# Altium project LEARNSAT_POBOY_v3.2.0.PrjPcb (part 1 of 2)
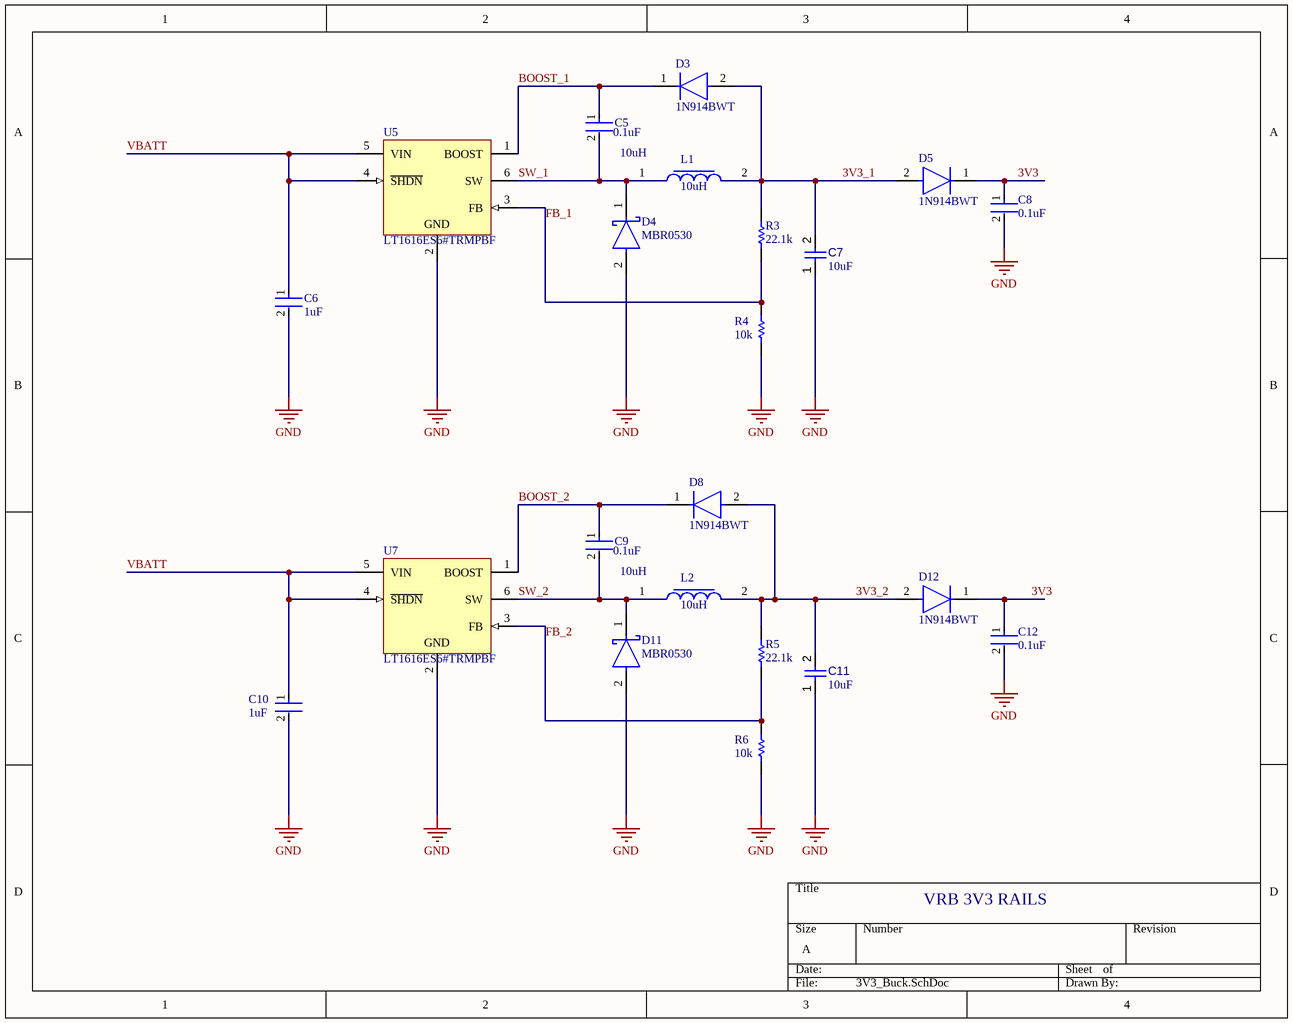
[diagram p0: 3V3_Buck.SchDoc]
15 sheets, 250 parts. Net scope: flat (ports and power ports of the same name join across sheets).
Board file: PoBoI.PcbDoc
Sheets:
  3V3_Buck.SchDoc
  3V3Primary.SchDoc
  3V3Secondary.SchDoc
  5V_Buck.SchDoc
  5VPrimary.SchDoc
  5VSecondary.SchDoc
  12V_BOOST.SchDoc
  MemoryLatch.SchDoc
  PC104.SchDoc
  STM32.SchDoc
  TVS_Diodes.SchDoc
  VBATTPrimary.SchDoc
  VBATTSecondary.SchDoc
  WatchDog.SchDoc
  12VPrimary.SchDoc

## Sheet 3V3_Buck.SchDoc
size A; SheetNumber: 1; SheetTotal: 15; SPICEModelCacheKMHHWGDA: <root> / <DocumentId>KMHHWGDA</DocumentId> / <CacheFrame Number="0"> / <Model Name="lm317" Kind="CKT"> / <Text>*------------------------------------------------- / * POSITIVE ADJUSTABLE VOLTAGE REGULATOR / .SUBCKT LM317 IN ADJ OUT / JADJ IN ADJ ADJ JADJMOD / VREF 4 ADJ 1.250 / DBK IN 13 DMOD / CBC 13 15 800.0E-12 / RBC 15 5 1.000E3 / QPASS 13 5 OUT QPASSMOD / RB1 7 6 1 / RB2 6 5 128.3 / DSC 6 11 DMOD / ESC 11 OUT VALUE={5.646-.6667*V(6,5)*V(13,5)} / DFB 6 12 DMOD / EFB 12 OUT VALUE={8.822-.4024*V(13,5)+5.250E-3*V(13,5)*V(13,5) -.6667*V(13,5)*V(6,5)} / EB 7 OUT 8 OUT 6.939 / RP 9 8 100 / CPZ 10 OUT 3.183E-6 / DPU 10 OUT DMOD / RZ 8 10 .1 / EP 9 OUT 4 OUT 100 / RI OUT 4 100MEG / .MODEL QPASSMOD NPN (IS=30F BF=50 VAF=1.500 NF=1.701) / .MODEL JADJMOD NJF (BETA=50.00E-6 VTO=-1) / .MODEL DMOD D (IS=30F N=1.701) / .ENDS</Text> / </Model> / </CacheFrame> / </root>

### Parts
(Parts that share a designator on the sheet are numbered #1, #2 ... from top to bottom, then left to right.)
C5#1  0.1uF  [FP-C0603-CJ-MFG]
C6#1  1uF  [FP-CL10-IPC_B]
C7#1  value 10uF  [CAPC0603(1608)100_L]  (hidden comment: Capacitor 10µF +/-20% 10V 0603)
C8#1  0.1uF  [FP-C0603-CJ-MFG]
C9  0.1uF  [FP-C0603-CJ-MFG]
C10#1  1uF  [FP-CL10-IPC_B]
C11#1  value 10uF  [CAPC0603(1608)100_L]  (hidden comment: Capacitor 10µF +/-20% 10V 0603)
C12#1  0.1uF  [FP-C0603-CJ-MFG]
D3#1  1N914BWT  [FP-502-01-MFG]
D4#1  MBR0530  [FP-425-04-MFG]
D5  1N914BWT  [FP-502-01-MFG]
D8  1N914BWT  [FP-502-01-MFG]
D11  MBR0530  [FP-425-04-MFG]
D12  1N914BWT  [FP-502-01-MFG]
L1#1  Inductance: 10uH  [INDM3532X15N]  (hidden comment: PA4547.103NLT)
L2#1  Inductance: 10uH  [INDM3532X15N]  (hidden comment: PA4547.103NLT)
R3  22.1k  [RESC1609X50X30LL10T20]
R4  10k  [RESC1609X50X30NL8T20]
R5  22.1k  [RESC1609X50X30LL10T20]
R6  10k  [RESC1609X50X30NL8T20]
U5  LT1616ES6#TRMPBF  [LT-S6-6-SOT-23_M]
U7  LT1616ES6#TRMPBF  [LT-S6-6-SOT-23_M]

### Nets
GND: C6#1.2 C7#1.1 C8#1.2 C10#1.2 C11#1.1 C12#1.2 D4#1.2(A) D11.2(A) R4.1 R6.1 U5.2(GND) U7.2(GND)
3V3: C8#1.1 C12#1.1 D5.1(C) D12.1(C)
3V3_1: C7#1.2 D3#1.2(A) D5.2(A) L1#1.2 R3.2
3V3_2: C11#1.2 D8.2(A) D12.2(A) L2#1.2 R5.2
BOOST_1: C5#1.1 D3#1.1(C) U5.1(BOOST)
BOOST_2: C9.1 D8.1(C) U7.1(BOOST)
FB_1: R3.1 R4.2 U5.3(FB)
FB_2: R5.1 R6.2 U7.3(FB)
SW_1: C5#1.2 D4#1.1(C) L1#1.1 U5.6(SW)
SW_2: C9.2 D11.1(C) L2#1.1 U7.6(SW)
VBATT: C6#1.1 C10#1.1 U5.4(~{SHDN}) U5.5(VIN) U7.4(~{SHDN}) U7.5(VIN)

### Notes on the sheet
- (near L1#1) 10uH
- (near L2#1) 10uH
- VRB 3V3 RAILS

### Library data of the parts
C5#1 C8#1 C9 C12#1 = CMP-2006-03300-2: CAP CER 0.1UF 50V X7R 0603 / C0603X104K5RACTU; Manufacturer: Kemet; Capacitance: 100nF; Material: Ceramic; Tolerance: 10%; Value: 100nF; Temperature Coefficient: 15%; Temperature Range High: +125°C; Temperature Range Low: -55°C; Manufacturer Part Number: C0603X104K5RACTU; Voltage: 50V; ComponentLink2Description: Datasheet; RoHS: TRUE; ComponentLink2URL: https://content.kemet.com/datasheets/KEM_C1013_X7R_FT-CAP_SMD.pdf; Device Class L3: Ceramic Capacitors; Device Class L2: Capacitors; Package: C0603-CJ; Height: 0.95mm; Device Class L1: Passive Components; Temperature Characteristic: X7R; Lead Free: Yes; Digikey Description: CAP CER 0.1UF 50V X7R 0603; Automotive: No; Mouser Description: Capacitor; Ceramic; Cap 0.1uF; Tol+10%; SMT; Flexible Termination; Vol-Rtg 50V; TR; Temperature: -55°C to +125°C; Octopart: https://octopart.com/c0603x104k5ractu-kemet-9145062; Category: Cap; Voltage Rating: 50V; Ipc Land Pattern Name: CAPC16080X80
C6#1 C10#1 = CMP-13271-001107-1: Cap Ceramic 1uF 25V X7R ±10% Pad SMD 0603 +125°C T/R; Width: 0.031inch; Voltage Rating: 25V; Length: 0.063inch; Min Operating Temperature: -55°C; Package Quantity: 1; Tolerance: 10%; Case Code (Metric): 1608; Case/Package: 0603; Mount: Surface Mount; Thickness: 0.035inch; Lead Free: Lead Free; Case Code (Imperial): 0603; Capacitance: 1uF; Depth: 0.8mm; Dielectric: X7R; Max Operating Temperature: 125°C; Radiation Hardening: No; Packaging: Tape and Reel; Height: 0.8mm
C7#1 C11#1 = CMP-001-00075-4: Chip Capacitor, 10µF +/-20%, 10V, 0603, Thickness 1 mm; Tolerance: 10%; Voltage Rating: 10V; Max Operating Temperature: 85°C; Pins: 2; Case/Package: 0603; Mounting Technology: SMT; Min Operating Temperature: -55°C
D3#1 D5 D8 D12 = CMP-07163-000008-1: DIODE GEN PURP 75V 200MA SOD523F; Manufacturer: ON Semiconductor; Forward Current: 300mA; Capacitance: 4pF; Max Junction Temp: +150°C; Reverse Voltage: 100V; Value: 4pF; Peak Reverse Current: 5uA; ComponentLink2Description: Datasheet; Package: 502-01; Manufacturer Part Number: 1N914BWT; Digikey Description: DIODE GEN PURP 75V 200MA SOD523F; Temperature Range High: +150°C; Temperature: -55°C to +150°C; Footprint Url: https://www.onsemi.com/pub/Collateral/502-01.PDF; Device Class L2: Diodes; Lead Free: Yes; Automotive: No; Category: Diode; Octopart: https://octopart.com/1n914bwt-on+semiconductor-84323166; Device Class L1: Discrete Semiconductors; Ipc Land Pattern Name: SODFL16080X60; Device Class L3: Rectifier Diodes; Height: 0.7mm; Max Repetitive Reverse Voltage: 75V; Mouser Description: Diodes - General Purpose, Power, Switching SINGLE JUNC. 100V 4.0NS COMP; Temperature Range Low: -55°C; ComponentLink2URL: https://www.onsemi.com/pub/Collateral/1N914BWT-D.pdf; RoHS: TRUE
D4#1 D11 = CMP-2000-05113-2: DIODE SCHOTTKY 30V 500MA SOD123; Polarity: Standard; Max Reverse Leakage Current: 130uA; Forward Voltage: 430mV; Element Configuration: Single; Peak Non-Repetitive Surge Current: 5.5A; REACH SVHC: No SVHC; Contact Plating: Tin; Width: 1.6mm; Weight: 0.03g; Max Reverse Voltage (DC): 30V; Mount: Surface Mount; Max Repetitive Reverse Voltage (Vrrm): 30V; Number of Pins: 2; Height: 1.03mm; Current Rating: 500mA; Max Forward Surge Current (Ifsm): 5.5A; Lead Free: Lead Free; Max Surge Current: 5.5A; Peak Reverse Current: 130uA; Min Operating Temperature: -65°C; Radiation Hardening: No; Max Operating Temperature: 150°C; Average Rectified Current: 500mA; Packaging: Tape and Reel; Length: 2.7mm; Forward Current: 500mA; Voltage Rating (DC): 30V; Package Quantity: 1; Output Current: 500mA; Part Number: *
L1#1 L2#1 = CMP-006-00022-2: Inductor Power Molded Wirewound 10uH 20% 100KHz 1.2A 0.522Ohm DCR Automotive T/R; DC Resistance MAX: 522 mOhms; Rated Current: 1.20A; Saturation Current: 1.6A; DC Resistance Typical: 435 mOhms
R3 R5 = CMP-2000-03094-1: Part Number: CRCW060322K1FKEA; Manufacturer: Vishay Dale
R4 R6 = CMP-1666-00005-4: Chip Resistor, 10 KOhm, +/- 1%, 100 mW, -55 to 155 degC, 0603 (1608 Metric), RoHS, Tape and Reel / CRCW060310K0FKEA; Manufacturer: Vishay Semiconductor; Voltage Rating: 75 V; Value: 1K; Max Operating Temperature: 155 degC; PackageDescription: 2-Pin Surface Mount Device, Body 1.575 x 0.85 mm; ComponentLink1Description: Manufacturer URL; RoHSCompliant: true; PackageReference: 0603; REACH SVHC: Unknown; Length: 1.55 mm; DatasheetVersion: 06/2012; Packaging: Tape and Reel; Min Operating Temperature: -55 degC; Mounting Technology: Surface Mount; ComponentLink2URL: https://datasheet.ciiva.com/11809/0900766b80d98afc-11809037.pdf; Height: 0.45 mm; ComponentLink2Description: Datasheet; Package Quantity: 5000; ComponentLink1URL: http://www.vishay.com/
U5 U7 = CMP-0491-01627-1: 600 mA, 1.4 MHz Step-Down Switching Regulator, 6-pin SOT23 (S6-6), -40 to 85 degC, Pb-Free, Mini Tape and Reel; Manufacturer: Linear Technology; Number of Outputs: 1; PackageDescription: 6-Pin Plastic SOT-23, Body 1.625 x 2.9 mm, Pitch 0.95 mm; ComponentLink1Description: Manufacturer URL; Mounting Technology: Surface Mount; PackageVersion: Aug-07; ComponentLink3Description: Package Specification; PackageReference: S6-6; RoHS: TRUE; ComponentLink1URL: http://www.linear.com/; ComponentLink2Description: Datasheet; Packing: Mini Tape and Reel; PartNumber: LT1616ES6#TRMPBF; ComponentLink2URL: http://cds.linear.com/docs/en/datasheet/lt1616fs.pdf; ComponentLink3URL: http://cds.linear.com/docs/en/datasheet/175435f.pdf

## Sheet 3V3Primary.SchDoc
size A; SheetNumber: 13; SheetTotal: 18
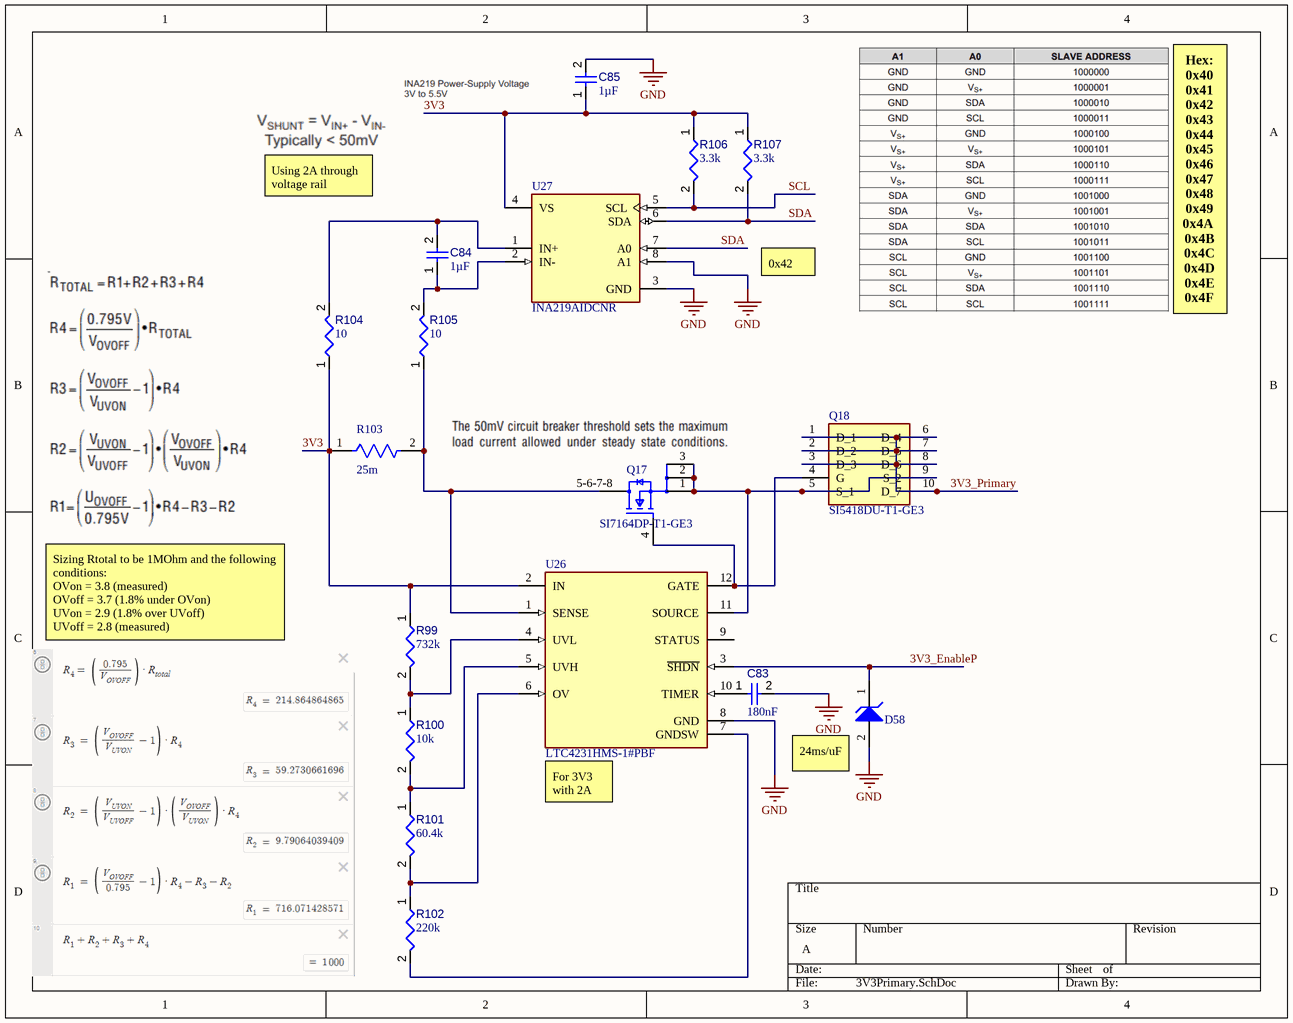
[diagram p1: 3V3Primary.SchDoc]

### Parts
(Parts that share a designator on the sheet are numbered #1, #2 ... from top to bottom, then left to right.)
C83  value 180nF  [FP-C0805C-DN-IPC_A]  (hidden comment: C0805C184K5RACTU)
C84  value 1µF  [CAPC1608X90X40LL10T20]  (hidden comment: Capacitor 1 uF +/- 10% 25 V 0603)
C85  value 1µF  [CAPC1608X90X35ML15T15]  (hidden comment: Capacitor 1uF +/- 10% 16V 0603)
D58  MM3Z3V6T1G  [ONSC-SOD-323-2-477-02_V]  (value not drawn)
Q17  SI7164DP-T1-GE3  [Vishay_S17-0173-SINGLE_MFG]
Q18  SI5418DU-T1-GE3  [SI5418DU-T1-GE3-Footprint-1]
R99  value 732k  [FP-CR0805-IPC_A]  (hidden comment: CR0805-FX-7323ELF)
R100  value 10k  [RESC1005X40X25ML05T05]  (hidden comment: Resistor 10k +/-1% 0402 100 mW)
R101  value 60.4k  [RESC1005X40X25NL05T10]  (hidden comment: RC0402FR-0760K4L)
R102  value 220k  [FP-ESR01-IPC_C]  (hidden comment: ESR01MZPJ224)
R103  Resistance: 25m  [FP-CSR1206-IPC_C]  (hidden comment: CSR1206FK25L0)
R104  value 10  [RESC0402(1005)_L]  (hidden comment: Resistor 10R  +/-1 % 0402 63 mW)
R105  value 10  [RESC0402(1005)_L]  (hidden comment: Resistor 10R  +/-1 % 0402 63 mW)
R106  value 3.3k  [FP-CRCW1210-e3-IPC_C]  (hidden comment: CRCW12103K30JNEA)
R107  value 3.3k  [FP-CRCW1210-e3-IPC_C]  (hidden comment: CRCW12103K30JNEA)
U26#1  LTC4231HMS-1#PBF  [FP-MS-12-05-08-1668-MFG]
U27#1  INA219AIDCNR  [FP-DCN0008A-IPC_A]

### Nets
GND: C83.2 C85.2 D58.2(A) U26#1.8(GND) U27#1.3(GND) U27#1.8(A1)
3V3: C85.1 R99.1 R103.1 R104.1 R106.1 R107.1 U26#1.2(IN) U27#1.4(VS)
3V3_EnableP: D58.1(K) U26#1.3(~{SHDN})
3V3_Primary: Q18.1(D_1) Q18.2(D_2) Q18.3(D_3) Q18.6(D_4) Q18.7(D_5) Q18.8(D_6) Q18.10(D_7)
SCL: R106.2 U27#1.5(SCL)
SDA: R107.2 U27#1.6(SDA) U27#1.7(A0)
NetC83_1: C83.1 U26#1.10(TIMER)
NetC84_1: C84.1 R105.2 U27#1.2(IN-)
NetC84_2: C84.2 R104.2 U27#1.1(IN+)
NetQ17_1: Q17.1(S) Q17.2(S) Q17.3(S) Q18.5(S_1) Q18.9(S_2) U26#1.11(SOURCE)
NetQ17_4: Q17.4(G) Q18.4(G) U26#1.12(GATE)
NetQ17_5-6-7-8: Q17.5-6-7-8(D) R103.2 R105.1 U26#1.1(SENSE)
NetR99_2: R99.2 R100.1 U26#1.4(UVL)
NetR100_2: R100.2 R101.1 U26#1.5(UVH)
NetR101_2: R101.2 R102.1 U26#1.6(OV)
NetR102_2: R102.2 U26#1.7(GNDSW)

Not connected (* = marked no-connect by the designer): U26#1 9(STATUS)

### Notes on the sheet
- Using 2A through voltage rail
- 0x42
- Hex:
  0x40
  0x41
  0x42
  0x43
  0x44
  0x45
  0x46
  0x47
  0x48
  0x49
  0x4A
  0x4B
  0x4C
  0x4D
  0x4E
  0x4F
- Sizing Rtotal to be 1MOhm and the following conditions:
  OVon = 3.8 (measured)
  OVoff = 3.7 (1.8% under OVon)
  UVon = 2.9 (1.8% over UVoff)
  UVoff = 2.8 (measured)
- (near D58) 24ms/uF
- (near U26#1) For 3V3
  with 2A

### Library data of the parts
C83 = CMP-001-00086-1: Ceramic Capacitor, Multilayer, Ceramic, 50V, 10% +Tol, 10% -Tol, X7R, 15% TC, 0.18uF, Surface Mount, 0805; Capacitor Type: Ceramic; Mounting Technology: Surface Mount; Pins: 2; Min Operating Temperature: -55°C; Case/Package: 0805; Max Operating Temperature: 125°C; RoHS Compliant: Yes
C84 = CMP-001-00005-6: Chip Capacitor, 1 uF, +/- 10%, 25 V, 0603 (1608 Metric); Capacitor Type: Ceramic; Voltage Rating: 25V; Pins: 2; Mounting Technology: SM; RoHS Compliant: True; Max Operating Temperature: 125°C; Case/Package: 0603; Min Operating Temperature: -55°C; Tolerance: 10%
C85 = CMP-001-00004-6: Chip Capacitor, 1 uF, +/- 10%, 16 V, 0603 (1608 Metric); Capacitor Type: Ceramic; Mounting Technology: SM; RoHS Compliant: True; Min Operating Temperature: -55°C; Case/Package: 0603; Pins: 2; Voltage Rating: 16V; Max Operating Temperature: 125°C; Tolerance: 10%
D58 = CMP-1060-00650-1: Zener Voltage Regulator, 300 mW, 2-Pin SOD-323, Pb-Free, Tape and Reel; Manufacturer: On Semiconductor; VZ Typ (V): 3.6; P Max (W): 0.3; RoHS: Pb-Free; ComponentLink1URL: http://www.onsemi.com/; PackageVersion: Rev. H, 03/2007; PartNumber: MM3Z3V6T1G; ComponentLink2Description: Datasheet; ComponentLink2URL: http://www.onsemi.cn/pub_link/Collateral/MM3Z2V4T1-D.PDF; DatasheetVersion: Rev. 9; PackageReference: SOD-323-2-477-02; ComponentLink3URL: http://www.onsemi.com/pub_link/Collateral/477-02.PDF.1; Packing: Tape and Reel; Mounting Technology: Surface Mount; ComponentLink3Description: Package Specification; PackageDescription: 2-Pin SOD, Body 1.7 x 1.25 mm; ComponentLink1Description: Manufacturer URL
Q17 = CMP-013-00040-1: Power Field-Effect Transistor, 23.5A I(D), 60V, 0.00625ohm, 1-Element, N-Channel, Silicon, Metal-oxide Semiconductor FET; Pins: 5; RoHS Compliant: Yes; Max Operating Temperature: 150°C
Q18 = CMP-013-00041-1: Power Field-Effect Transistor, 11.6A I(D), 30V, 0.0145ohm, 1-Element, N-Channel, Silicon, Metal-oxide Semiconductor FET; Max Operating Temperature: 150°C; RoHS Compliant: Yes; Pins: 3
R99 = CMP-009-00197-1: Fixed Resistor, Metal Glaze/thick Film, 0.125W, 732000ohm, 150V, 1% +/-Tol, 100ppm/Cel, Surface Mount, 0805; Power: 125mW; Case/Package: 0805; RoHS Compliant: Yes; Min Operating Temperature: -55°C; Max Operating Temperature: 155°C; Mounting Technology: Surface Mount; Pins: 2; Tolerance: 1%
R100 = CMP-009-00015-5: Chip Resistor, 10 KOhm, +/- 1%, 0.1 W, -55 to 155 degC, 0402 (1005 Metric); Voltage Rating: 50V; Power: 100mW; Case/Package: 0402; RoHS Compliant: True; Min Operating Temperature: -55°C; Mounting Technology: SM; Tolerance: 1%; Max Operating Temperature: 155°C; Pins: 2
R101 = CMP-009-00202-1: Fixed Resistor, Metal Glaze/thick Film, 0.0625W, 60400ohm, 50V, 1% +/-Tol, 100ppm/Cel, Surface Mount, 0402; Power: 62.5mW; Case/Package: 0402; Tolerance: 1%; RoHS Compliant: Yes; Max Operating Temperature: 155°C; Pins: 2; Mounting Technology: Surface Mount; Min Operating Temperature: -55°C
R102 = CMP-009-00204-1: Fixed Resistor, Metal Glaze/thick Film, 0.2W, 220000ohm, 50V, 5% +/-Tol, 200ppm/Cel, Surface Mount, 0402; Power: 200mW; Max Operating Temperature: 155°C; Tolerance: 5%; RoHS Compliant: Yes; Pins: 2; Mounting Technology: Surface Mount; Case/Package: 0402; Min Operating Temperature: -55°C
R103 = CMP-26527-000133-1: General Purpose Thick Film Chip Resistor, 1206, 25mΩ, 1%, 0.5W; Max Power Dissipation: 500mW; Temperature Coefficient: 100ppm/°C; Lead Free: Lead Free; Military Standard: Not; Case Code (Imperial): 1206; Max Operating Temperature: 155°C; Case Code (Metric): 3216; Height: 0.026inch; Packaging: Tape and Reel; Case/Package: 1206; Series: CSR; Number of Terminations: 2; RoHS Compliant: Yes; Mount: Surface Mount; Depth: 1.55mm; Contact Plating: Tin; Length: 0.12inch; Radiation Hardening: No; Width: 0.061inch; Size Code: 1206; Power Rating: 500mW; Min Operating Temperature: -55°C; Tolerance: 1%; Resistor Type: Thick Film; Construction: Rectangular
R104 R105 = CMP-009-00152-3: Chip Resistor, 10 Ohms, +/-1 %, 63 mW, -55 to 155 degC, 0402; Tolerance: 1%; Power: 63mW; Pins: 2; Max Operating Temperature: 155°C; Min Operating Temperature: -55°C; Case/Package: 0402
R106 R107 = CMP-009-00192-1: Fixed Resistor, Metal Glaze/thick Film, 0.5W, 3300ohm, 200V, 5% +/-Tol, 200ppm/Cel, Surface Mount, 1210; Power: 500mW; RoHS Compliant: Yes; Max Operating Temperature: 155°C; Case/Package: 1210; Min Operating Temperature: -55°C; Mounting Technology: Surface Mount; Tolerance: 5%; Pins: 2
U26#1 = CMP-09134-000012-1: IC HOT SWAP CTRLR GP 12MSOP; Operating Supply Current: 4uA; Number of Channels: 1; Min Supply Voltage: 2.7V; Max Supply Voltage: 36V; Number of Pins: 12; Features: Latched Fault; Max Operating Temperature: 125°C; Mount: Surface Mount; Packaging: Rail/Tube; Min Operating Temperature: -40°C; REACH SVHC: No SVHC; Case/Package: MSOP; RoHS Compliant: Yes
U27#1 = CMP-010-00025-1: Power Supply Support Circuit, Fixed, 2 Channel, 2V, PDSO8; Nominal Supply Voltage: 3.3V; Max Supply Voltage: 5.5V; Min Supply Voltage: 3V; Case/Package: LSSOP; Max Operating Temperature: 125°C; Min Operating Temperature: -40°C; Pins: 8; RoHS Compliant: Yes

## Sheet 3V3Secondary.SchDoc
size A; SheetNumber: 3; SheetTotal: 15
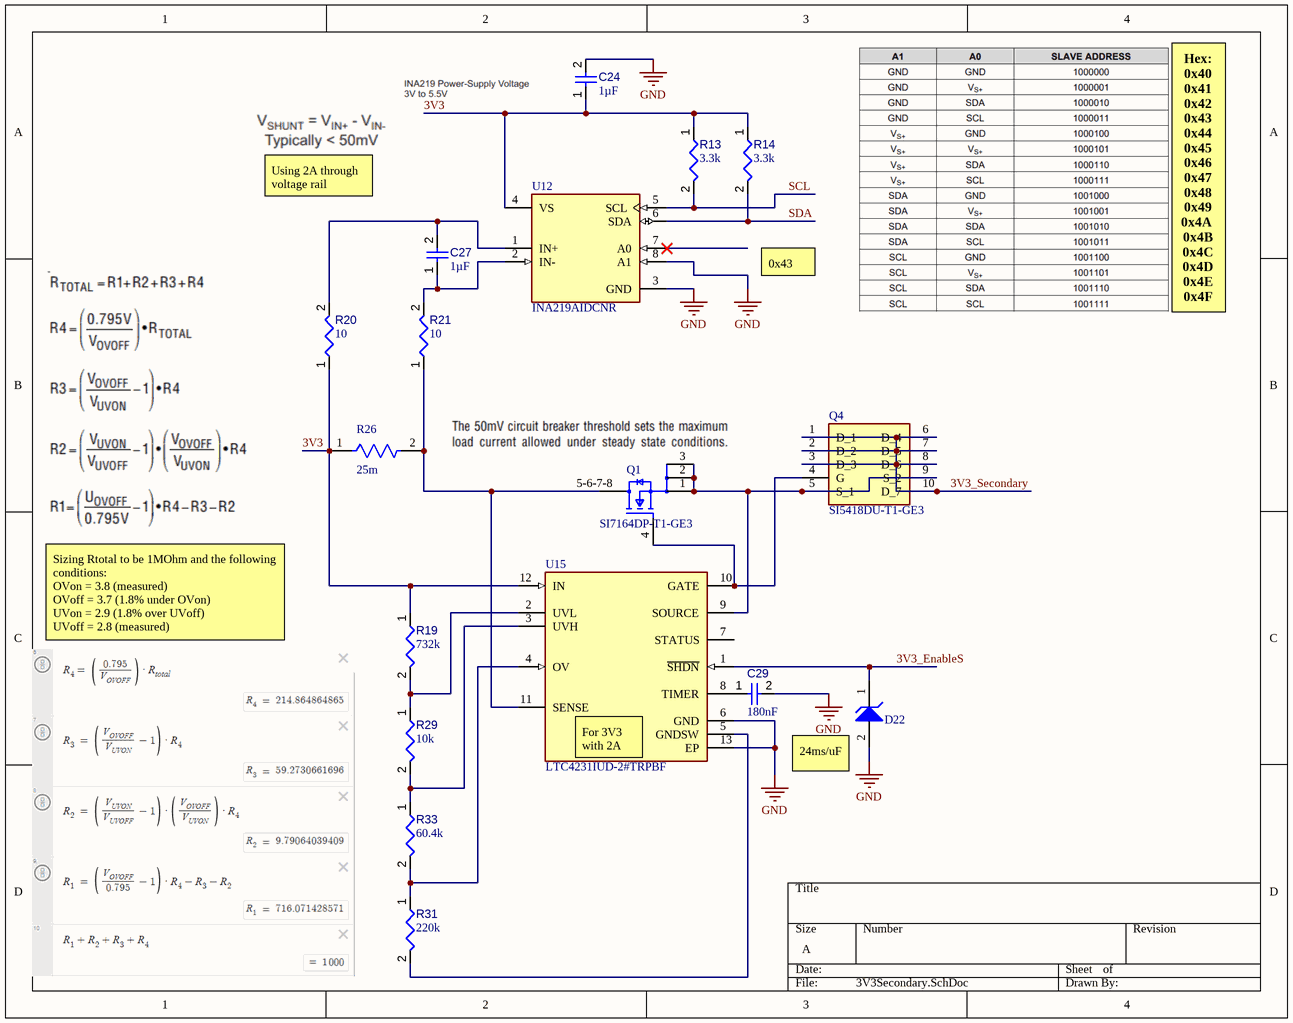
[diagram p2: 3V3Secondary.SchDoc]

### Parts
(Parts that share a designator on the sheet are numbered #1, #2 ... from top to bottom, then left to right.)
C24  value 1µF  [CAPC1608X90X35ML15T15]  (hidden comment: Capacitor 1uF +/- 10% 16V 0603)
C27  value 1µF  [CAPC1608X90X40LL10T20]  (hidden comment: Capacitor 1 uF +/- 10% 25 V 0603)
C29  value 180nF  [FP-C0805C-DN-IPC_A]  (hidden comment: C0805C184K5RACTU)
D22  MM3Z3V6T1G  [ONSC-SOD-323-2-477-02_V]  (value not drawn)
Q1  SI7164DP-T1-GE3  [Vishay_S17-0173-SINGLE_MFG]
Q4  SI5418DU-T1-GE3  [SI5418DU-T1-GE3-Footprint-1]
R13  value 3.3k  [FP-CRCW1210-e3-IPC_C]  (hidden comment: CRCW12103K30JNEA)
R14  value 3.3k  [FP-CRCW1210-e3-IPC_C]  (hidden comment: CRCW12103K30JNEA)
R19  value 732k  [FP-CR0805-IPC_A]  (hidden comment: CR0805-FX-7323ELF)
R20  value 10  [RESC0402(1005)_L]  (hidden comment: Resistor 10R  +/-1 % 0402 63 mW)
R21  value 10  [RESC0402(1005)_L]  (hidden comment: Resistor 10R  +/-1 % 0402 63 mW)
R26#1  Resistance: 25m  [FP-CSR1206-IPC_C]  (hidden comment: CSR1206FK25L0)
R29  value 10k  [RESC1005X40X25ML05T05]  (hidden comment: Resistor 10k +/-1% 0402 100 mW)
R31  value 220k  [FP-ESR01-IPC_C]  (hidden comment: ESR01MZPJ224)
R33  value 60.4k  [RESC1005X40X25NL05T10]  (hidden comment: RC0402FR-0760K4L)
U12  INA219AIDCNR  [FP-DCN0008A-IPC_A]
U15  LTC4231IUD-2#TRPBF  [FP-UD-12-05-08-1855-IPC_A]

### Nets
GND: C24.2 C29.2 D22.2(A) U12.3(GND) U12.8(A1) U15.6(GND) U15.13(EP)
3V3: C24.1 R13.1 R14.1 R19.1 R20.1 R26#1.1 U12.4(VS) U15.12(IN)
3V3_EnableS: D22.1(K) U15.1(~{SHDN})
3V3_Secondary: Q4.1(D_1) Q4.2(D_2) Q4.3(D_3) Q4.6(D_4) Q4.7(D_5) Q4.8(D_6) Q4.10(D_7)
SCL: R13.2 U12.5(SCL)
SDA: R14.2 U12.6(SDA)
NetC27_1: C27.1 R21.2 U12.2(IN-)
NetC27_2: C27.2 R20.2 U12.1(IN+)
NetC29_1: C29.1 U15.8(TIMER)
NetQ1_1: Q1.1(S) Q1.2(S) Q1.3(S) Q4.5(S_1) Q4.9(S_2) U15.9(SOURCE)
NetQ1_4: Q1.4(G) Q4.4(G) U15.10(GATE)
NetQ1_5-6-7-8: Q1.5-6-7-8(D) R21.1 R26#1.2 U15.11(SENSE)
NetR19_2: R19.2 R29.1 U15.2(UVL)
NetR29_2: R29.2 R33.1 U15.3(UVH)
NetR31_1: R31.1 R33.2 U15.4(OV)
NetR31_2: R31.2 U15.5(GNDSW)

Not connected (* = marked no-connect by the designer): U12 7(A0)*; U15 7(STATUS)

### Notes on the sheet
- Using 2A through voltage rail
- 0x43
- Hex:
  0x40
  0x41
  0x42
  0x43
  0x44
  0x45
  0x46
  0x47
  0x48
  0x49
  0x4A
  0x4B
  0x4C
  0x4D
  0x4E
  0x4F
- Sizing Rtotal to be 1MOhm and the following conditions:
  OVon = 3.8 (measured)
  OVoff = 3.7 (1.8% under OVon)
  UVon = 2.9 (1.8% over UVoff)
  UVoff = 2.8 (measured)
- (near U15) For 3V3
  with 2A
- (near D22) 24ms/uF

### Library data of the parts
C24 = CMP-001-00004-6: as C85 on sheet 3V3Primary; Mounting Technology: SM; RoHS Compliant: True; Min Operating Temperature: -55°C; Case/Package: 0603; Pins: 2; Voltage Rating: 16V; Max Operating Temperature: 125°C; Tolerance: 10%
C27 = CMP-001-00005-6: as C84 on sheet 3V3Primary; Pins: 2; Mounting Technology: SM; RoHS Compliant: True; Max Operating Temperature: 125°C; Case/Package: 0603; Min Operating Temperature: -55°C; Tolerance: 10%
C29 = CMP-001-00086-1: as C83 on sheet 3V3Primary; Capacitor Type: Ceramic; Mounting Technology: Surface Mount; Pins: 2; Min Operating Temperature: -55°C; Case/Package: 0805; Max Operating Temperature: 125°C; RoHS Compliant: Yes
D22 = CMP-1060-00650-1: as D58 on sheet 3V3Primary; RoHS: Pb-Free; ComponentLink1URL: http://www.onsemi.com/; PackageVersion: Rev. H, 03/2007; PartNumber: MM3Z3V6T1G; ComponentLink2Description: Datasheet; ComponentLink2URL: http://www.onsemi.cn/pub_link/Collateral/MM3Z2V4T1-D.PDF; DatasheetVersion: Rev. 9; PackageReference: SOD-323-2-477-02; ComponentLink3URL: http://www.onsemi.com/pub_link/Collateral/477-02.PDF.1; Packing: Tape and Reel; Mounting Technology: Surface Mount; ComponentLink3Description: Package Specification; PackageDescription: 2-Pin SOD, Body 1.7 x 1.25 mm; ComponentLink1Description: Manufacturer URL
Q1 = CMP-013-00040-1: as Q17 on sheet 3V3Primary; Pins: 5; RoHS Compliant: Yes; Max Operating Temperature: 150°C
Q4 = CMP-013-00041-1: as Q18 on sheet 3V3Primary; Max Operating Temperature: 150°C; RoHS Compliant: Yes; Pins: 3
R13 R14 = CMP-009-00192-1: as R106 on sheet 3V3Primary; RoHS Compliant: Yes; Max Operating Temperature: 155°C; Case/Package: 1210; Min Operating Temperature: -55°C; Mounting Technology: Surface Mount; Tolerance: 5%; Pins: 2
R19 = CMP-009-00197-1: as R99 on sheet 3V3Primary; Case/Package: 0805; RoHS Compliant: Yes; Min Operating Temperature: -55°C; Max Operating Temperature: 155°C; Mounting Technology: Surface Mount; Pins: 2; Tolerance: 1%
R20 R21 = CMP-009-00152-3: as R104 on sheet 3V3Primary; Pins: 2; Max Operating Temperature: 155°C; Min Operating Temperature: -55°C; Case/Package: 0402
R26#1 = CMP-26527-000133-1: as R103 on sheet 3V3Primary; Lead Free: Lead Free; Military Standard: Not; Case Code (Imperial): 1206; Max Operating Temperature: 155°C; Case Code (Metric): 3216; Height: 0.026inch; Packaging: Tape and Reel; Case/Package: 1206; Series: CSR; Number of Terminations: 2; RoHS Compliant: Yes; Mount: Surface Mount; Depth: 1.55mm; Contact Plating: Tin; Length: 0.12inch; Radiation Hardening: No; Width: 0.061inch; Size Code: 1206; Power Rating: 500mW; Min Operating Temperature: -55°C; Tolerance: 1%; Resistor Type: Thick Film; Construction: Rectangular
R29 = CMP-009-00015-5: as R100 on sheet 3V3Primary; Case/Package: 0402; RoHS Compliant: True; Min Operating Temperature: -55°C; Mounting Technology: SM; Tolerance: 1%; Max Operating Temperature: 155°C; Pins: 2
R31 = CMP-009-00204-1: as R102 on sheet 3V3Primary; Max Operating Temperature: 155°C; Tolerance: 5%; RoHS Compliant: Yes; Pins: 2; Mounting Technology: Surface Mount; Case/Package: 0402; Min Operating Temperature: -55°C
R33 = CMP-009-00202-1: as R101 on sheet 3V3Primary; Case/Package: 0402; Tolerance: 1%; RoHS Compliant: Yes; Max Operating Temperature: 155°C; Pins: 2; Mounting Technology: Surface Mount; Min Operating Temperature: -55°C
U12 = CMP-010-00025-1: as U27#1 on sheet 3V3Primary; Case/Package: LSSOP; Max Operating Temperature: 125°C; Min Operating Temperature: -40°C; Pins: 8; RoHS Compliant: Yes
U15 = CMP-019-00049-1: Switching Controller, CMOS, PQCC12; Max Supply Voltage: 36V; Pins: 12; Min Operating Temperature: -40°C; Case/Package: HVQCCN; RoHS Compliant: Yes; Max Operating Temperature: 85°C

## Sheet 5V_Buck.SchDoc
size A; SheetNumber: 5; SheetTotal: 12; SPICEModelCacheVYLUUOOD: <root> / <DocumentId>VYLUUOOD</DocumentId> / <CacheFrame Number="0"> / <Model Name="lm317" Kind="CKT"> / <Text>*------------------------------------------------- / * POSITIVE ADJUSTABLE VOLTAGE REGULATOR / .SUBCKT LM317 IN ADJ OUT / JADJ IN ADJ ADJ JADJMOD / VREF 4 ADJ 1.250 / DBK IN 13 DMOD / CBC 13 15 800.0E-12 / RBC 15 5 1.000E3 / QPASS 13 5 OUT QPASSMOD / RB1 7 6 1 / RB2 6 5 128.3 / DSC 6 11 DMOD / ESC 11 OUT VALUE={5.646-.6667*V(6,5)*V(13,5)} / DFB 6 12 DMOD / EFB 12 OUT VALUE={8.822-.4024*V(13,5)+5.250E-3*V(13,5)*V(13,5) -.6667*V(13,5)*V(6,5)} / EB 7 OUT 8 OUT 6.939 / RP 9 8 100 / CPZ 10 OUT 3.183E-6 / DPU 10 OUT DMOD / RZ 8 10 .1 / EP 9 OUT 4 OUT 100 / RI OUT 4 100MEG / .MODEL QPASSMOD NPN (IS=30F BF=50 VAF=1.500 NF=1.701) / .MODEL JADJMOD NJF (BETA=50.00E-6 VTO=-1) / .MODEL DMOD D (IS=30F N=1.701) / .ENDS</Text> / </Model> / </CacheFrame> / </root>
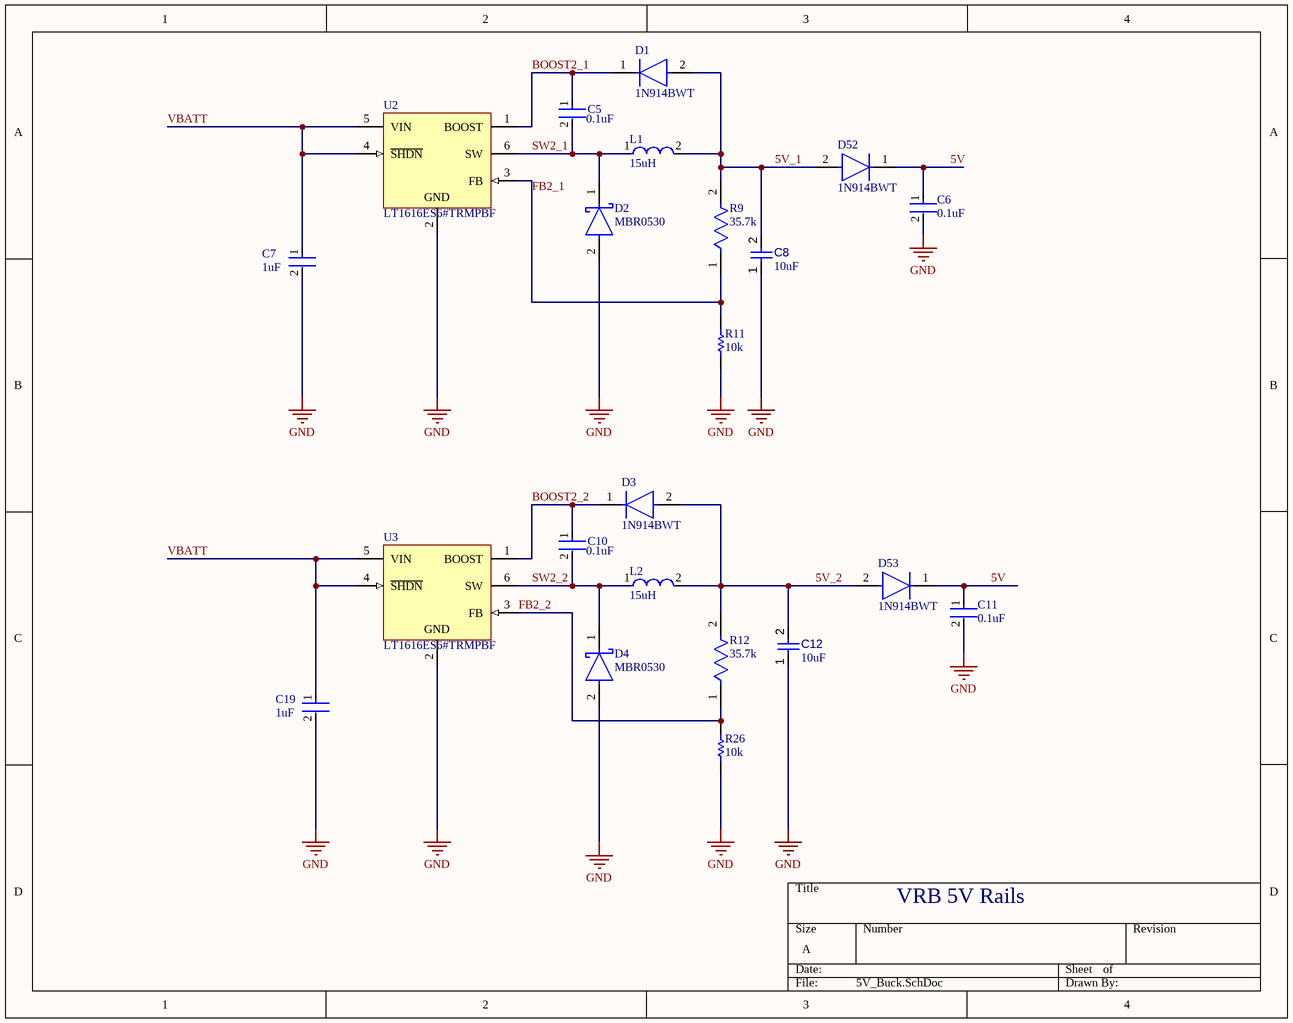
[diagram p3: 5V_Buck.SchDoc]

### Parts
(Parts that share a designator on the sheet are numbered #1, #2 ... from top to bottom, then left to right.)
C5#2  0.1uF  [FP-C0603-CJ-MFG]
C6#2  0.1uF  [FP-C0603-CJ-MFG]
C7#2  1uF  [FP-CL10-IPC_B]
C8#2  value 10uF  [CAPC0603(1608)100_L]  (hidden comment: Capacitor 10µF +/-20% 10V 0603)
C10#2  0.1uF  [FP-C0603-CJ-MFG]
C11#2  0.1uF  [FP-C0603-CJ-MFG]
C12#2  value 10uF  [CAPC0603(1608)100_L]  (hidden comment: Capacitor 10µF +/-20% 10V 0603)
C19  1uF  [FP-CL10-IPC_B]
D1#1  1N914BWT  [FP-502-01-MFG]
D2#1  MBR0530  [FP-425-04-MFG]
D3#2  1N914BWT  [FP-502-01-MFG]
D4#2  MBR0530  [FP-425-04-MFG]
D52  1N914BWT  [FP-502-01-MFG]
D53  1N914BWT  [FP-502-01-MFG]
L1#2  15uH  [FP-LQH43CN_03-MFG]
L2#2  15uH  [FP-LQH43CN_03-MFG]
R9  35.7k  [FP-CRCW0603-e3-IPC_C]
R11  10k  [RESC1609X50X30NL8T20]
R12  35.7k  [FP-CRCW0603-e3-IPC_C]
R26#2  10k  [RESC1609X50X30NL8T20]
U2#1  LT1616ES6#TRMPBF  [LT-S6-6-SOT-23_M]
U3#1  LT1616ES6#TRMPBF  [LT-S6-6-SOT-23_M]

### Nets
GND: C6#2.2 C7#2.2 C8#2.1 C11#2.2 C12#2.1 C19.2 D2#1.2(A) D4#2.2(A) R11.1 R26#2.1 U2#1.2(GND) U3#1.2(GND)
5V: C6#2.1 C11#2.1 D52.1(C) D53.1(C)
5V_1: C8#2.2 D1#1.2(A) D52.2(A) L1#2.2 R9.2
5V_2: C12#2.2 D3#2.2(A) D53.2(A) L2#2.2 R12.2
BOOST2_1: C5#2.1 D1#1.1(C) U2#1.1(BOOST)
BOOST2_2: C10#2.1 D3#2.1(C) U3#1.1(BOOST)
FB2_1: R9.1 R11.2 U2#1.3(FB)
FB2_2: R12.1 R26#2.2 U3#1.3(FB)
SW2_1: C5#2.2 D2#1.1(C) L1#2.1 U2#1.6(SW)
SW2_2: C10#2.2 D4#2.1(C) L2#2.1 U3#1.6(SW)
VBATT: C7#2.1 C19.1 U2#1.4(~{SHDN}) U2#1.5(VIN) U3#1.4(~{SHDN}) U3#1.5(VIN)

### Notes on the sheet
- VRB 5V Rails

### Library data of the parts
C5#2 C6#2 C10#2 C11#2 = CMP-2006-03300-2: as C5#1 on sheet 3V3_Buck; Temperature Range High: +125°C; Temperature Range Low: -55°C; Manufacturer Part Number: C0603X104K5RACTU; Voltage: 50V; ComponentLink2Description: Datasheet; RoHS: TRUE; ComponentLink2URL: https://content.kemet.com/datasheets/KEM_C1013_X7R_FT-CAP_SMD.pdf; Device Class L3: Ceramic Capacitors; Device Class L2: Capacitors; Package: C0603-CJ; Height: 0.95mm; Device Class L1: Passive Components; Temperature Characteristic: X7R; Lead Free: Yes; Digikey Description: CAP CER 0.1UF 50V X7R 0603; Automotive: No; Mouser Description: Capacitor; Ceramic; Cap 0.1uF; Tol+10%; SMT; Flexible Termination; Vol-Rtg 50V; TR; Temperature: -55°C to +125°C; Octopart: https://octopart.com/c0603x104k5ractu-kemet-9145062; Category: Cap; Voltage Rating: 50V; Ipc Land Pattern Name: CAPC16080X80
C7#2 C19 = CMP-13271-001107-1: Cap Ceramic 1uF 25V X7R ±10% Pad SMD 0603 +125°C T/R / CL10B105KA8NFNC; Width: 0.031inch; Voltage Rating: 25V; Length: 0.063inch; Min Operating Temperature: -55°C; Package Quantity: 1; Tolerance: 10%; Case Code (Metric): 1608; Case/Package: 0603; Mount: Surface Mount; Thickness: 0.035inch; Lead Free: Lead Free; Case Code (Imperial): 0603; Capacitance: 1uF; Depth: 0.8mm; Dielectric: X7R; Max Operating Temperature: 125°C; Radiation Hardening: No; Packaging: Tape and Reel; Height: 0.8mm
C8#2 C12#2 = CMP-001-00075-4: as C7#1 on sheet 3V3_Buck; Voltage Rating: 10V; Max Operating Temperature: 85°C; Pins: 2; Case/Package: 0603; Mounting Technology: SMT; Min Operating Temperature: -55°C
D1#1 D3#2 D52 D53 = CMP-07163-000008-1: as D3#1 on sheet 3V3_Buck; ComponentLink2Description: Datasheet; Package: 502-01; Manufacturer Part Number: 1N914BWT; Digikey Description: DIODE GEN PURP 75V 200MA SOD523F; Temperature Range High: +150°C; Temperature: -55°C to +150°C; Footprint Url: https://www.onsemi.com/pub/Collateral/502-01.PDF; Device Class L2: Diodes; Lead Free: Yes; Automotive: No; Category: Diode; Octopart: https://octopart.com/1n914bwt-on+semiconductor-84323166; Device Class L1: Discrete Semiconductors; Ipc Land Pattern Name: SODFL16080X60; Device Class L3: Rectifier Diodes; Height: 0.7mm; Max Repetitive Reverse Voltage: 75V; Mouser Description: Diodes - General Purpose, Power, Switching SINGLE JUNC. 100V 4.0NS COMP; Temperature Range Low: -55°C; ComponentLink2URL: https://www.onsemi.com/pub/Collateral/1N914BWT-D.pdf; RoHS: TRUE
D2#1 D4#2 = CMP-2000-05113-2: as D4#1 on sheet 3V3_Buck; REACH SVHC: No SVHC; Contact Plating: Tin; Width: 1.6mm; Weight: 0.03g; Max Reverse Voltage (DC): 30V; Mount: Surface Mount; Max Repetitive Reverse Voltage (Vrrm): 30V; Number of Pins: 2; Height: 1.03mm; Current Rating: 500mA; Max Forward Surge Current (Ifsm): 5.5A; Lead Free: Lead Free; Max Surge Current: 5.5A; Peak Reverse Current: 130uA; Min Operating Temperature: -65°C; Radiation Hardening: No; Max Operating Temperature: 150°C; Average Rectified Current: 500mA; Packaging: Tape and Reel; Length: 2.7mm; Forward Current: 500mA; Voltage Rating (DC): 30V; Package Quantity: 1; Output Current: 500mA
L1#2 L2#2 = CMP-06042-015693-1: Wire Wound Ferrite Inductor for General Circuits 15μH ±10% 0.73Ω 360mA 1812; Q Factor: 35; Test Frequency: 1MHz; Frequency: 19MHz; DC Resistance (DCR): 730mR; Shielding: Unshielded; Resistor Type: Wirewound; Case Code (Metric): 4532; Width: 3.2mm; Lead Free: Lead Free; Length: 4.5mm; Min Operating Temperature: -40°C; Height: 2.6mm; Military Standard: Not; Max Operating Temperature: 85°C; Self Resonant Frequency: 19MHz; Termination: SMD/SMT; Tolerance: 10%; DC Current: 360mA; Max DC Current: 360mA; Weight: 0.004586oz; Case Code (Imperial): 1812; Packaging: Tape and Reel; Series: LQH43M; Series Resistance: 730mR; Case/Package: 1812; Core Material: Ferrite; Current Rating: 360mA; Inductance: 15uH; Depth: 3.4mm; Mount: Surface Mount; Height - Seated (Max): 0.11inch; Radiation Hardening: No; Package Quantity: 500; Value: 15uH
R9 R12 = CMP-2000-03264-2: RES Thick Film, 35.7kΩ, 1%, 0.1W, 100ppm/°C, 0603; Max Power Dissipation: 100mW; Voltage Rating: 75V; Resistance: 35.7kR; Weight: 7.1E-05oz; Termination: Solder; Max Operating Temperature: 155°C; Military Standard: Not; Height: 0.45mm; Temperature Coefficient: 100ppm/°C; Contact Plating: Tin; Packaging: Tape and Reel; Radiation Hardening: No; Depth: 0.85mm; Number of Pins: 2; Length: 1.55mm; Composition: Thick Film; Case Code (Metric): 1608; Package Quantity: 10; Width: 0.033inch; Number of Terminations: 2; Power Rating: 100mW; Case/Package: 0603; Case Code (Imperial): 0603; Features: Automotive AEC-Q200; Tolerance: 1%; Min Operating Temperature: -55°C
R11 R26#2 = CMP-1666-00005-4: as R4 on sheet 3V3_Buck; Max Operating Temperature: 155 degC; PackageDescription: 2-Pin Surface Mount Device, Body 1.575 x 0.85 mm; ComponentLink1Description: Manufacturer URL; RoHSCompliant: true; PackageReference: 0603; REACH SVHC: Unknown; Length: 1.55 mm; DatasheetVersion: 06/2012; Packaging: Tape and Reel; Min Operating Temperature: -55 degC; Mounting Technology: Surface Mount; ComponentLink2URL: https://datasheet.ciiva.com/11809/0900766b80d98afc-11809037.pdf; Height: 0.45 mm; ComponentLink2Description: Datasheet; Package Quantity: 5000; ComponentLink1URL: http://www.vishay.com/
U2#1 U3#1 = CMP-0491-01627-1: as U5 on sheet 3V3_Buck; PackageDescription: 6-Pin Plastic SOT-23, Body 1.625 x 2.9 mm, Pitch 0.95 mm; ComponentLink1Description: Manufacturer URL; Mounting Technology: Surface Mount; PackageVersion: Aug-07; ComponentLink3Description: Package Specification; PackageReference: S6-6; RoHS: TRUE; ComponentLink1URL: http://www.linear.com/; ComponentLink2Description: Datasheet; Packing: Mini Tape and Reel; PartNumber: LT1616ES6#TRMPBF; ComponentLink2URL: http://cds.linear.com/docs/en/datasheet/lt1616fs.pdf; ComponentLink3URL: http://cds.linear.com/docs/en/datasheet/175435f.pdf

## Sheet 5VPrimary.SchDoc
size A; SheetNumber: 5; SheetTotal: 15
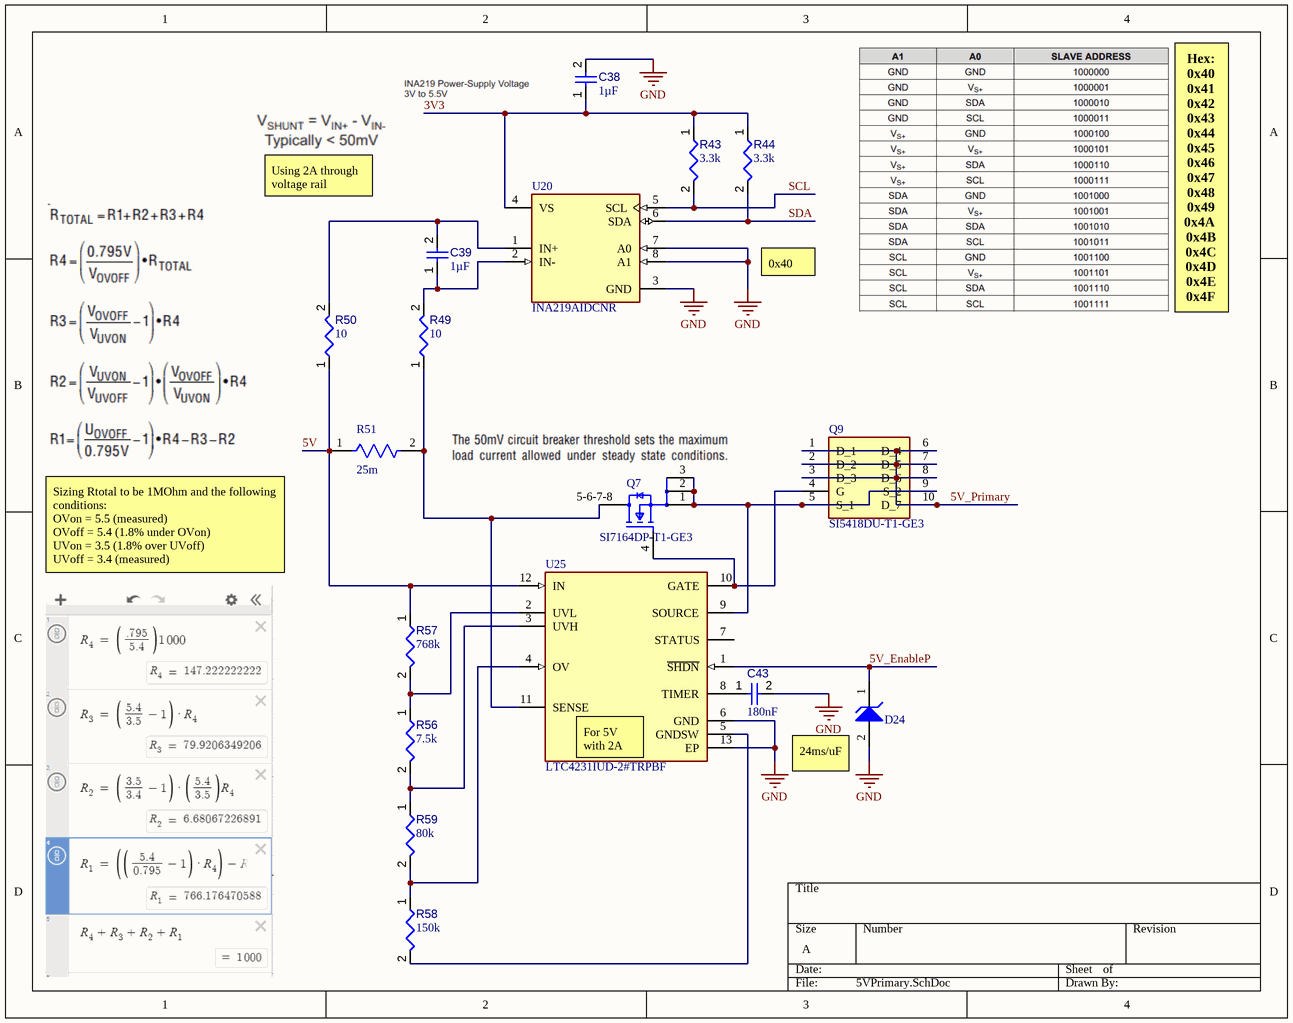
[diagram p4: 5VPrimary.SchDoc]

### Parts
C38  value 1µF  [CAPC1608X90X35ML15T15]  (hidden comment: Capacitor 1uF +/- 10% 16V 0603)
C39  value 1µF  [CAPC1608X90X40LL10T20]  (hidden comment: Capacitor 1 uF +/- 10% 25 V 0603)
C43  value 180nF  [FP-C0805C-DN-IPC_A]  (hidden comment: C0805C184K5RACTU)
D24  MM3Z3V6T1G  [ONSC-SOD-323-2-477-02_V]  (value not drawn)
Q7  SI7164DP-T1-GE3  [Vishay_S17-0173-SINGLE_MFG]
Q9  SI5418DU-T1-GE3  [SI5418DU-T1-GE3-Footprint-1]
R43  value 3.3k  [FP-CRCW1210-e3-IPC_C]  (hidden comment: CRCW12103K30JNEA)
R44  value 3.3k  [FP-CRCW1210-e3-IPC_C]  (hidden comment: CRCW12103K30JNEA)
R49  value 10  [RESC0402(1005)_L]  (hidden comment: Resistor 10R  +/-1 % 0402 63 mW)
R50  value 10  [RESC0402(1005)_L]  (hidden comment: Resistor 10R  +/-1 % 0402 63 mW)
R51  Resistance: 25m  [FP-CSR1206-IPC_C]  (hidden comment: CSR1206FK25L0)
R56  value 7.5k  [FP-CRCW1206-e3-IPC_A]  (hidden comment: CRCW12067K50FKEA)
R57  value 768k  [RESC0402(1005)_L]  (hidden comment: 768KR2F)
R58  value 150k  [FP-RT1206-IPC_C]  (hidden comment: RT1206FRE07150KL)
R59  value 80k  [FP-PTN0603-IPC_B]  (hidden comment: PTN0603E8002BST1)
U20  INA219AIDCNR  [FP-DCN0008A-IPC_A]
U25  LTC4231IUD-2#TRPBF  [FP-UD-12-05-08-1855-IPC_A]

### Nets
GND: C38.2 C43.2 D24.2(A) U20.3(GND) U20.7(A0) U20.8(A1) U25.6(GND) U25.13(EP)
3V3: C38.1 R43.1 R44.1 U20.4(VS)
5V: R50.1 R51.1 R57.1 U25.12(IN)
5V_EnableP: D24.1(K) U25.1(~{SHDN})
5V_Primary: Q9.1(D_1) Q9.2(D_2) Q9.3(D_3) Q9.6(D_4) Q9.7(D_5) Q9.8(D_6) Q9.10(D_7)
SCL: R43.2 U20.5(SCL)
SDA: R44.2 U20.6(SDA)
NetC39_1: C39.1 R49.2 U20.2(IN-)
NetC39_2: C39.2 R50.2 U20.1(IN+)
NetC43_1: C43.1 U25.8(TIMER)
NetQ7_1: Q7.1(S) Q7.2(S) Q7.3(S) Q9.5(S_1) Q9.9(S_2) U25.9(SOURCE)
NetQ7_4: Q7.4(G) Q9.4(G) U25.10(GATE)
NetQ7_5-6-7-8: Q7.5-6-7-8(D) R49.1 R51.2 U25.11(SENSE)
NetR56_1: R56.1 R57.2 U25.2(UVL)
NetR56_2: R56.2 R59.1 U25.3(UVH)
NetR58_1: R58.1 R59.2 U25.4(OV)
NetR58_2: R58.2 U25.5(GNDSW)

Not connected (* = marked no-connect by the designer): U25 7(STATUS)

### Notes on the sheet
- Using 2A through voltage rail
- 0x40
- Hex:
  0x40
  0x41
  0x42
  0x43
  0x44
  0x45
  0x46
  0x47
  0x48
  0x49
  0x4A
  0x4B
  0x4C
  0x4D
  0x4E
  0x4F
- Sizing Rtotal to be 1MOhm and the following conditions:
  OVon = 5.5 (measured)
  OVoff = 5.4 (1.8% under OVon)
  UVon = 3.5 (1.8% over UVoff)
  UVoff = 3.4 (measured)
- (near U25) For 5V
  with 2A
- (near D24) 24ms/uF

### Library data of the parts
C38 = CMP-001-00004-6: as C85 on sheet 3V3Primary; Mounting Technology: SM; RoHS Compliant: True; Min Operating Temperature: -55°C; Case/Package: 0603; Pins: 2; Voltage Rating: 16V; Max Operating Temperature: 125°C; Tolerance: 10%
C39 = CMP-001-00005-6: as C84 on sheet 3V3Primary; Pins: 2; Mounting Technology: SM; RoHS Compliant: True; Max Operating Temperature: 125°C; Case/Package: 0603; Min Operating Temperature: -55°C; Tolerance: 10%
C43 = CMP-001-00086-1: as C83 on sheet 3V3Primary; Capacitor Type: Ceramic; Mounting Technology: Surface Mount; Pins: 2; Min Operating Temperature: -55°C; Case/Package: 0805; Max Operating Temperature: 125°C; RoHS Compliant: Yes
D24 = CMP-1060-00650-1: as D58 on sheet 3V3Primary; RoHS: Pb-Free; ComponentLink1URL: http://www.onsemi.com/; PackageVersion: Rev. H, 03/2007; PartNumber: MM3Z3V6T1G; ComponentLink2Description: Datasheet; ComponentLink2URL: http://www.onsemi.cn/pub_link/Collateral/MM3Z2V4T1-D.PDF; DatasheetVersion: Rev. 9; PackageReference: SOD-323-2-477-02; ComponentLink3URL: http://www.onsemi.com/pub_link/Collateral/477-02.PDF.1; Packing: Tape and Reel; Mounting Technology: Surface Mount; ComponentLink3Description: Package Specification; PackageDescription: 2-Pin SOD, Body 1.7 x 1.25 mm; ComponentLink1Description: Manufacturer URL
Q7 = CMP-013-00040-1: as Q17 on sheet 3V3Primary; Pins: 5; RoHS Compliant: Yes; Max Operating Temperature: 150°C
Q9 = CMP-013-00041-1: as Q18 on sheet 3V3Primary; Max Operating Temperature: 150°C; RoHS Compliant: Yes; Pins: 3
R43 R44 = CMP-009-00192-1: as R106 on sheet 3V3Primary; RoHS Compliant: Yes; Max Operating Temperature: 155°C; Case/Package: 1210; Min Operating Temperature: -55°C; Mounting Technology: Surface Mount; Tolerance: 5%; Pins: 2
R49 R50 = CMP-009-00152-3: as R104 on sheet 3V3Primary; Pins: 2; Max Operating Temperature: 155°C; Min Operating Temperature: -55°C; Case/Package: 0402
R51 = CMP-26527-000133-1: as R103 on sheet 3V3Primary; Lead Free: Lead Free; Military Standard: Not; Case Code (Imperial): 1206; Max Operating Temperature: 155°C; Case Code (Metric): 3216; Height: 0.026inch; Packaging: Tape and Reel; Case/Package: 1206; Series: CSR; Number of Terminations: 2; RoHS Compliant: Yes; Mount: Surface Mount; Depth: 1.55mm; Contact Plating: Tin; Length: 0.12inch; Radiation Hardening: No; Width: 0.061inch; Size Code: 1206; Power Rating: 500mW; Min Operating Temperature: -55°C; Tolerance: 1%; Resistor Type: Thick Film; Construction: Rectangular
R56 = CMP-009-00195-1: Fixed Resistor, Metal Glaze/thick Film, 0.25W, 7500ohm, 200V, 1% +/-Tol, 100ppm/Cel, Surface Mount, 1206; Power: 250mW; RoHS Compliant: Yes; Pins: 2; Tolerance: 1%; Min Operating Temperature: -55°C; Max Operating Temperature: 155°C; Case/Package: 1206; Mounting Technology: Surface Mount
R57 = CMP-009-00110-2: 768K 0.063W 1% 0402 (1005 Metric)  SMD; Power: 63mW; Tolerance: 1%; Mounting Technology: SMT; Pins: 2; Case/Package: 0402
R58 = CMP-009-00193-1: Fixed Resistor, Thin Film, 0.25W, 150000ohm, 200V, 1% +/-Tol, 50ppm/Cel, Surface Mount, 1206; Power: 250mW; Pins: 2; Case/Package: 1206; Tolerance: 1%; Mounting Technology: Surface Mount; Max Operating Temperature: 155°C; RoHS Compliant: Yes; Min Operating Temperature: -55°C
R59 = CMP-009-00194-1: Fixed Resistor, Thin Film, 0.15W, 80000ohm, 75V, 0.1% +/-Tol, 25ppm/Cel, Surface Mount, 0603; Power: 150mW; Case/Package: 0603; RoHS Compliant: Yes; Pins: 2; Mounting Technology: Surface Mount; Max Operating Temperature: 150°C; Tolerance: 0.1%; Min Operating Temperature: -55°C
U20 = CMP-010-00025-1: as U27#1 on sheet 3V3Primary; Case/Package: LSSOP; Max Operating Temperature: 125°C; Min Operating Temperature: -40°C; Pins: 8; RoHS Compliant: Yes
U25 = CMP-019-00049-1: as U15 on sheet 3V3Secondary; Pins: 12; Min Operating Temperature: -40°C; Case/Package: HVQCCN; RoHS Compliant: Yes; Max Operating Temperature: 85°C

## Sheet 5VSecondary.SchDoc
size A; SheetNumber: 6; SheetTotal: 15
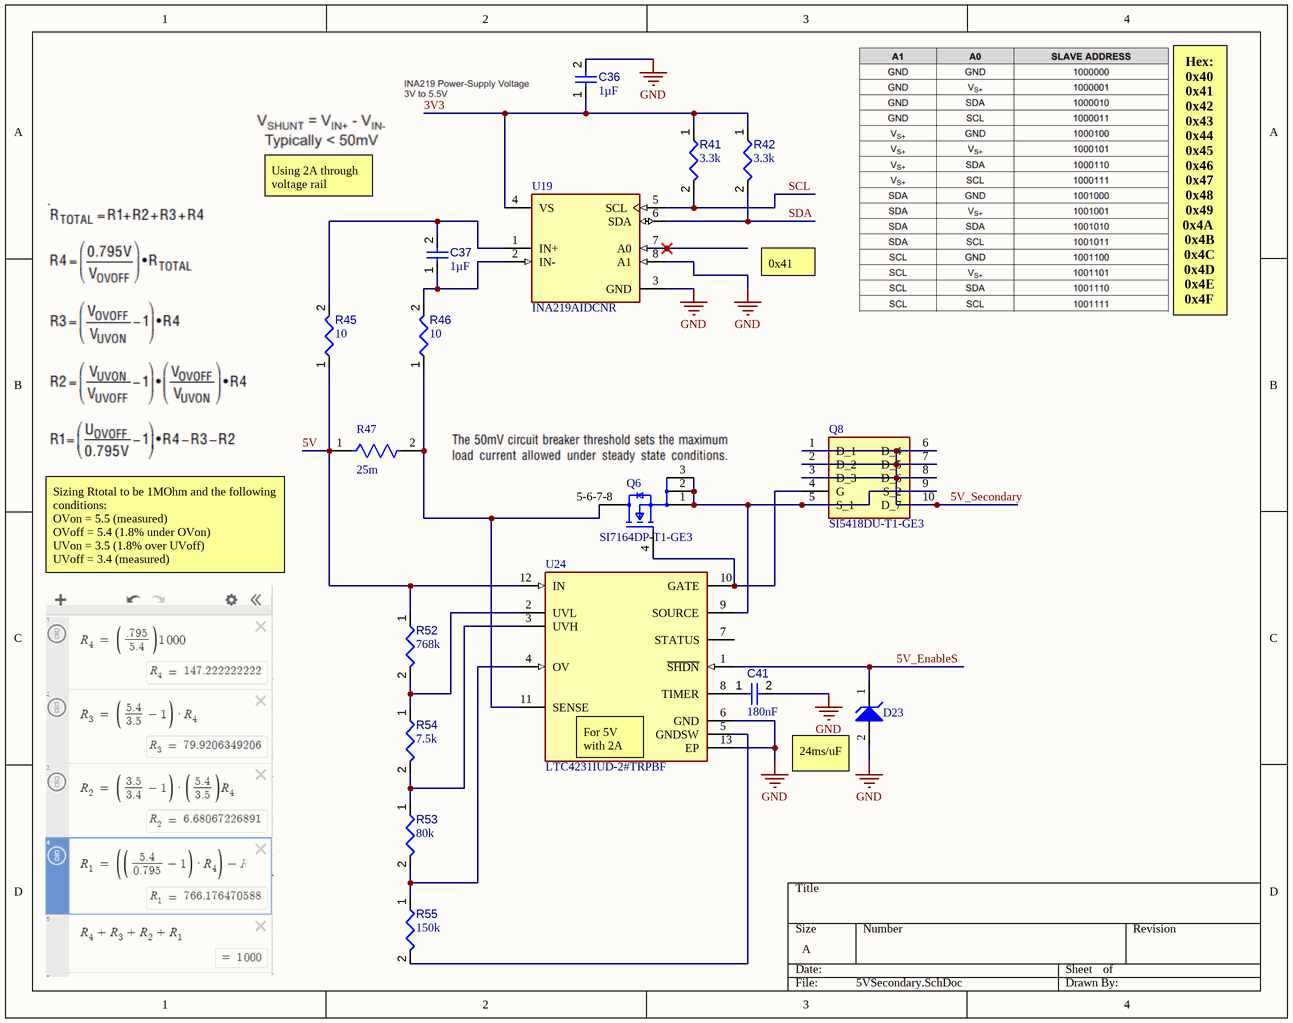
[diagram p5: 5VSecondary.SchDoc]

### Parts
C36  value 1µF  [CAPC1608X90X35ML15T15]  (hidden comment: Capacitor 1uF +/- 10% 16V 0603)
C37  value 1µF  [CAPC1608X90X40LL10T20]  (hidden comment: Capacitor 1 uF +/- 10% 25 V 0603)
C41  value 180nF  [FP-C0805C-DN-IPC_A]  (hidden comment: C0805C184K5RACTU)
D23  MM3Z3V6T1G  [ONSC-SOD-323-2-477-02_V]  (value not drawn)
Q6  SI7164DP-T1-GE3  [Vishay_S17-0173-SINGLE_MFG]
Q8  SI5418DU-T1-GE3  [SI5418DU-T1-GE3-Footprint-1]
R41  value 3.3k  [FP-CRCW1210-e3-IPC_C]  (hidden comment: CRCW12103K30JNEA)
R42  value 3.3k  [FP-CRCW1210-e3-IPC_C]  (hidden comment: CRCW12103K30JNEA)
R45  value 10  [RESC0402(1005)_L]  (hidden comment: Resistor 10R  +/-1 % 0402 63 mW)
R46  value 10  [RESC0402(1005)_L]  (hidden comment: Resistor 10R  +/-1 % 0402 63 mW)
R47  Resistance: 25m  [FP-CSR1206-IPC_C]  (hidden comment: CSR1206FK25L0)
R52  value 768k  [RESC0402(1005)_L]  (hidden comment: 768KR2F)
R53  value 80k  [FP-PTN0603-IPC_B]  (hidden comment: PTN0603E8002BST1)
R54  value 7.5k  [FP-CRCW1206-e3-IPC_A]  (hidden comment: CRCW12067K50FKEA)
R55  value 150k  [FP-RT1206-IPC_C]  (hidden comment: RT1206FRE07150KL)
U19  INA219AIDCNR  [FP-DCN0008A-IPC_A]
U24  LTC4231IUD-2#TRPBF  [FP-UD-12-05-08-1855-IPC_A]

### Nets
GND: C36.2 C41.2 D23.2(A) U19.3(GND) U19.8(A1) U24.6(GND) U24.13(EP)
3V3: C36.1 R41.1 R42.1 U19.4(VS)
5V: R45.1 R47.1 R52.1 U24.12(IN)
5V_EnableS: D23.1(K) U24.1(~{SHDN})
5V_Secondary: Q8.1(D_1) Q8.2(D_2) Q8.3(D_3) Q8.6(D_4) Q8.7(D_5) Q8.8(D_6) Q8.10(D_7)
SCL: R41.2 U19.5(SCL)
SDA: R42.2 U19.6(SDA)
NetC37_1: C37.1 R46.2 U19.2(IN-)
NetC37_2: C37.2 R45.2 U19.1(IN+)
NetC41_1: C41.1 U24.8(TIMER)
NetQ6_1: Q6.1(S) Q6.2(S) Q6.3(S) Q8.5(S_1) Q8.9(S_2) U24.9(SOURCE)
NetQ6_4: Q6.4(G) Q8.4(G) U24.10(GATE)
NetQ6_5-6-7-8: Q6.5-6-7-8(D) R46.1 R47.2 U24.11(SENSE)
NetR52_2: R52.2 R54.1 U24.2(UVL)
NetR53_1: R53.1 R54.2 U24.3(UVH)
NetR53_2: R53.2 R55.1 U24.4(OV)
NetR55_2: R55.2 U24.5(GNDSW)

Not connected (* = marked no-connect by the designer): U19 7(A0)*; U24 7(STATUS)

### Notes on the sheet
- Using 2A through voltage rail
- 0x41
- Hex:
  0x40
  0x41
  0x42
  0x43
  0x44
  0x45
  0x46
  0x47
  0x48
  0x49
  0x4A
  0x4B
  0x4C
  0x4D
  0x4E
  0x4F
- Sizing Rtotal to be 1MOhm and the following conditions:
  OVon = 5.5 (measured)
  OVoff = 5.4 (1.8% under OVon)
  UVon = 3.5 (1.8% over UVoff)
  UVoff = 3.4 (measured)
- (near U24) For 5V
  with 2A
- (near D23) 24ms/uF

### Library data of the parts
C36 = CMP-001-00004-6: as C85 on sheet 3V3Primary; Mounting Technology: SM; RoHS Compliant: True; Min Operating Temperature: -55°C; Case/Package: 0603; Pins: 2; Voltage Rating: 16V; Max Operating Temperature: 125°C; Tolerance: 10%
C37 = CMP-001-00005-6: as C84 on sheet 3V3Primary; Pins: 2; Mounting Technology: SM; RoHS Compliant: True; Max Operating Temperature: 125°C; Case/Package: 0603; Min Operating Temperature: -55°C; Tolerance: 10%
C41 = CMP-001-00086-1: as C83 on sheet 3V3Primary; Capacitor Type: Ceramic; Mounting Technology: Surface Mount; Pins: 2; Min Operating Temperature: -55°C; Case/Package: 0805; Max Operating Temperature: 125°C; RoHS Compliant: Yes
D23 = CMP-1060-00650-1: as D58 on sheet 3V3Primary; RoHS: Pb-Free; ComponentLink1URL: http://www.onsemi.com/; PackageVersion: Rev. H, 03/2007; PartNumber: MM3Z3V6T1G; ComponentLink2Description: Datasheet; ComponentLink2URL: http://www.onsemi.cn/pub_link/Collateral/MM3Z2V4T1-D.PDF; DatasheetVersion: Rev. 9; PackageReference: SOD-323-2-477-02; ComponentLink3URL: http://www.onsemi.com/pub_link/Collateral/477-02.PDF.1; Packing: Tape and Reel; Mounting Technology: Surface Mount; ComponentLink3Description: Package Specification; PackageDescription: 2-Pin SOD, Body 1.7 x 1.25 mm; ComponentLink1Description: Manufacturer URL
Q6 = CMP-013-00040-1: as Q17 on sheet 3V3Primary; Pins: 5; RoHS Compliant: Yes; Max Operating Temperature: 150°C
Q8 = CMP-013-00041-1: as Q18 on sheet 3V3Primary; Max Operating Temperature: 150°C; RoHS Compliant: Yes; Pins: 3
R41 R42 = CMP-009-00192-1: as R106 on sheet 3V3Primary; RoHS Compliant: Yes; Max Operating Temperature: 155°C; Case/Package: 1210; Min Operating Temperature: -55°C; Mounting Technology: Surface Mount; Tolerance: 5%; Pins: 2
R45 R46 = CMP-009-00152-3: as R104 on sheet 3V3Primary; Pins: 2; Max Operating Temperature: 155°C; Min Operating Temperature: -55°C; Case/Package: 0402
R47 = CMP-26527-000133-1: as R103 on sheet 3V3Primary; Lead Free: Lead Free; Military Standard: Not; Case Code (Imperial): 1206; Max Operating Temperature: 155°C; Case Code (Metric): 3216; Height: 0.026inch; Packaging: Tape and Reel; Case/Package: 1206; Series: CSR; Number of Terminations: 2; RoHS Compliant: Yes; Mount: Surface Mount; Depth: 1.55mm; Contact Plating: Tin; Length: 0.12inch; Radiation Hardening: No; Width: 0.061inch; Size Code: 1206; Power Rating: 500mW; Min Operating Temperature: -55°C; Tolerance: 1%; Resistor Type: Thick Film; Construction: Rectangular
R52 = CMP-009-00110-2: as R57 on sheet 5VPrimary; Tolerance: 1%; Mounting Technology: SMT; Pins: 2; Case/Package: 0402
R53 = CMP-009-00194-1: as R59 on sheet 5VPrimary; Case/Package: 0603; RoHS Compliant: Yes; Pins: 2; Mounting Technology: Surface Mount; Max Operating Temperature: 150°C; Tolerance: 0.1%; Min Operating Temperature: -55°C
R54 = CMP-009-00195-1: as R56 on sheet 5VPrimary; RoHS Compliant: Yes; Pins: 2; Tolerance: 1%; Min Operating Temperature: -55°C; Max Operating Temperature: 155°C; Case/Package: 1206; Mounting Technology: Surface Mount
R55 = CMP-009-00193-1: as R58 on sheet 5VPrimary; Pins: 2; Case/Package: 1206; Tolerance: 1%; Mounting Technology: Surface Mount; Max Operating Temperature: 155°C; RoHS Compliant: Yes; Min Operating Temperature: -55°C
U19 = CMP-010-00025-1: as U27#1 on sheet 3V3Primary; Case/Package: LSSOP; Max Operating Temperature: 125°C; Min Operating Temperature: -40°C; Pins: 8; RoHS Compliant: Yes
U24 = CMP-019-00049-1: as U15 on sheet 3V3Secondary; Pins: 12; Min Operating Temperature: -40°C; Case/Package: HVQCCN; RoHS Compliant: Yes; Max Operating Temperature: 85°C

## Sheet 12V_BOOST.SchDoc
size A; SheetNumber: 7; SheetTotal: 15
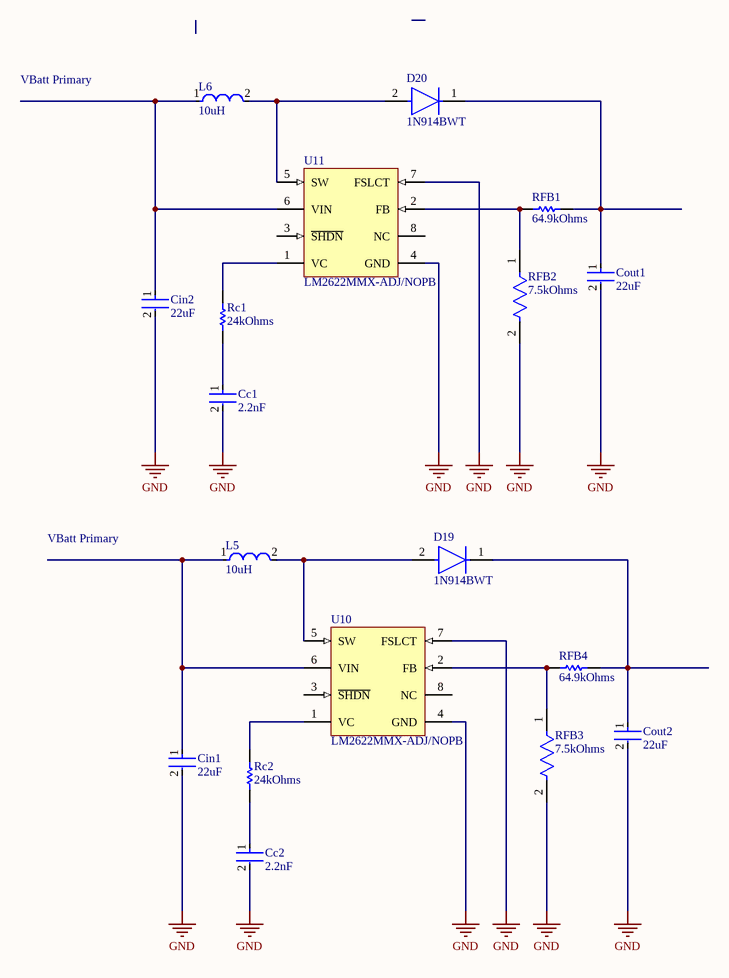
[diagram p6: 12V_BOOST.SchDoc]

### Parts
Cc1  2.2nF  [FP-C0402-BB-MFG]
Cc2  2.2nF  [FP-C0402-BB-MFG]
Cin1  22uF  [FP-CL31-IPC_A]
Cin2  22uF  [FP-CL31-IPC_A]
Cout1  22uF  [FP-CL31-IPC_A]
Cout2  22uF  [FP-CL31-IPC_A]
D19  1N914BWT  [FP-502-01-MFG]
D20  1N914BWT  [FP-502-01-MFG]
L5  10uH  [FP-MLZ1608-IPC_C]
L6  10uH  [FP-MLZ1608-IPC_C]
Rc1  24kOhms  [RESC1005X40X25ML05T05]
Rc2  24kOhms  [RESC1005X40X25ML05T05]
RFB1  64.9kOhms  [RESC3216X70X50NL05T20]
RFB2  7.5kOhms  [FP-ERJ3EK-MFG]
RFB3  7.5kOhms  [FP-ERJ3EK-MFG]
RFB4  64.9kOhms  [RESC3216X70X50NL05T20]
U10  LM2622MMX-ADJ/NOPB  [DGK0008A_M]
U11  LM2622MMX-ADJ/NOPB  [DGK0008A_M]

### Nets
GND: Cc1.2 Cc2.2 Cin1.2 Cin2.2 Cout1.2 Cout2.2 RFB2.2 RFB3.2 U10.4(GND) U10.7(FSLCT) U11.4(GND) U11.7(FSLCT)
NetCc1_1: Cc1.1 Rc1.2
NetCc2_1: Cc2.1 Rc2.2
NetCin1_1: Cin1.1 L5.1 U10.6(VIN)
NetCin2_1: Cin2.1 L6.1 U11.6(VIN)
NetCout1_1: Cout1.1 D20.1(C) RFB1.2
NetCout2_1: Cout2.1 D19.1(C) RFB4.2
NetD19_2: D19.2(A) L5.2 U10.5(SW)
NetD20_2: D20.2(A) L6.2 U11.5(SW)
NetRc1_1: Rc1.1 U11.1(VC)
NetRc2_1: Rc2.1 U10.1(VC)
NetRFB1_1: RFB1.1 RFB2.1 U11.2(FB)
NetRFB3_1: RFB3.1 RFB4.1 U10.2(FB)

Not connected (* = marked no-connect by the designer): U10 3(~{SHDN}) 8(NC); U11 3(~{SHDN}) 8(NC)

### Notes on the sheet
- VBatt Primary

### Library data of the parts
Cc1 Cc2 = CMP-2008-03290-2: CAP CER 2200PF 25V 5% NP0 0402; Manufacturer: Kemet; Manufacturer Part Number: C0402C222J3GACTU; Temperature Characteristic: C0G; Temperature Coefficient: 15%; Value: 2,200 pF; Tolerance: 0.05; Temperature: -55°C to +125°C; ComponentLink2URL: https://content.kemet.com/datasheets/KEM_C1002_X7R_SMD.pdf; Octopart: https://octopart.com/c0402c222j3gactu-kemet-9145102; Ipc Land Pattern Name: CAPC10050X50; RoHS: TRUE; Temperature Range High: +125°C; Device Class L3: Ceramic Capacitors; Device Class L1: Passive Components; Digikey Description: CAP CER 2200PF 25V 5% NP0 0402; Capacitance: 2,200 pF; Voltage Rating: 25 V; Automotive: No; Lead Free: Yes; ComponentLink2Description: Datasheet; Material: Ceramic; Package: C0402-BB; Temperature Range Low: -55°C; Device Class L2: Capacitors; Height: 0.55mm; Category: Cap; Mouser Description: Multilayer Ceramic Capacitors MLCC - SMD/SMT 25V 0.0022uF 5% C0G
Cin1 Cin2 Cout1 Cout2 = CMP-13271-002013-1: Cap Ceramic 22uF 16V X5R ±20% SMD 1206 +85°C Embossed T/R; Height: 0.85mm; Min Operating Temperature: -55°C; Thickness: 0.037inch; Depth: 1.6mm; Length: 3.2mm; Tolerance: 20%; Case Code (Imperial): 1206; Capacitance: 22uF; Package Quantity: 1; Radiation Hardening: No; Case/Package: 1206; Dielectric: X5R; Packaging: Tape and Reel; Voltage: 16V; Case Code (Metric): 3216; Width: 0.063inch; Lead Free: Lead Free; Mount: Surface Mount; Voltage Rating: 16V; Max Operating Temperature: 85°C
D19 D20 = CMP-07163-000008-1: as D3#1 on sheet 3V3_Buck; ComponentLink2Description: Datasheet; Package: 502-01; Manufacturer Part Number: 1N914BWT; Digikey Description: DIODE GEN PURP 75V 200MA SOD523F; Temperature Range High: +150°C; Temperature: -55°C to +150°C; Footprint Url: https://www.onsemi.com/pub/Collateral/502-01.PDF; Device Class L2: Diodes; Lead Free: Yes; Automotive: No; Category: Diode; Octopart: https://octopart.com/1n914bwt-on+semiconductor-84323166; Device Class L1: Discrete Semiconductors; Ipc Land Pattern Name: SODFL16080X60; Device Class L3: Rectifier Diodes; Height: 0.7mm; Max Repetitive Reverse Voltage: 75V; Mouser Description: Diodes - General Purpose, Power, Switching SINGLE JUNC. 100V 4.0NS COMP; Temperature Range Low: -55°C; ComponentLink2URL: https://www.onsemi.com/pub/Collateral/1N914BWT-D.pdf; RoHS: TRUE
L5 L6 = CMP-08253-000012-2: Shielded Multilayer Inductor 10uH ±20% 250mA 1365mΩ SMD 0603; Core Material: Ferrite; Resistance: 1.05R; Test Frequency: 2MHz; DC Resistance (DCR): 1.365R; Self Resonant Frequency: 50MHz; Saturation Current: 90mA; Tolerance: 20%; Current Rating: 250mA; Mount: Surface Mount; Inductance: 10uH; Package Quantity: 4000; Max Operating Temperature: 125°C; RoHS Compliant: Yes; Length: 0.063inch; Case Code (Metric): 1608; Packaging: Tape and Reel; Case/Package: 0603; Min Operating Temperature: -55°C; Case Code (Imperial): 0603; Height - Seated (Max): 0.037inch; Shielding: Shielded; Width: 0.031inch
Rc1 Rc2 = CMP-2002-08403-1: Part Number: CRCW040224K0FKED; Manufacturer: Vishay Dale
RFB1 RFB4 = CMP-2003-00461-1: Part Number: ERJ-8ENF64R9V; Manufacturer: Panasonic
RFB2 RFB3 = CMP-2000-00636-2: RES SMD 7.5K OHM 1% 1/10W 0603; Voltage Rating: 75V; Resistance: 7.5kR; Voltage Rating (DC): 50V; Max Power Dissipation: 100mW; Temperature Coefficient: 100ppm/°C; Military Standard: Not; Package Quantity: 1; Radiation Hardening: No; Max Operating Temperature: 155°C; Depth: 0.8mm; Mount: Surface Mount; Lead Free: Lead Free; REACH SVHC: No SVHC; Termination: SMD/SMT; Number of Terminations: 2; RoHS Compliant: Yes; Min Operating Temperature: -55°C; Case Code (Imperial): 0603; Features: Automotive AEC-Q200; Tolerance: 1%; Length: 1.6mm; Height: 0.022inch; Power Rating: 100mW; Width: 0.8mm; Resistor Type: Thick Film; Case/Package: 0603; Construction: Rectangular; Case Code (Metric): 1608; Contact Plating: Tin; Resistance Tolerance: 1%; Packaging: Tape and Reel; Series: ERJ
U10 U11 = CMP-0069-01733-3: 600kHz/1.3MHz Step-up PWM DC/DC Converter, 8-pin MSOP, Pb-Free; Manufacturer: Texas Instruments; PowerWise: N; CompType: Switcher; PackageTopMarking: ZXTT*S18B; PackageReference: DGK0008A; RoHS: Y; Code_JEDEC: MO-187-AA; ComponentLink1URL: http://www.ti.com/general/docs/lit/getliterature.tsp?genericPartNumber=LM2622&fileType=pdf; PackageDescription: MINI SOIC, .118 x .118 x .034in, 8 Lead, .0256in Pitch; ComponentLink1Description: Datasheet URL; PinCount: 8

## Sheet MemoryLatch.SchDoc
size A; SheetNumber: 18; SheetTotal: 18
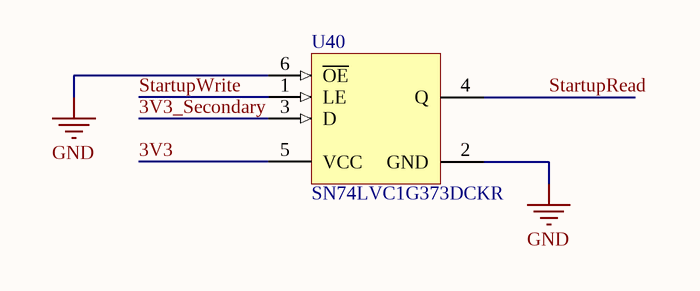
[diagram p7: MemoryLatch.SchDoc]

### Parts
U40  SN74LVC1G373DCKR  [DCK0006A_M]

### Nets
GND: U40.2(GND) U40.6(~{OE})
3V3: U40.5(VCC)
3V3_Secondary: U40.3(D)
StartupRead: U40.4(Q)
StartupWrite: U40.1(LE)

### Library data of the parts
U40 = CMP-019-00050-1: Bus Driver, LVC/LCX/Z Series, 1-Func, 1-Bit, True Output, CMOS, PDSO6; Min Supply Voltage: 1.65V; Max Supply Voltage: 5.5V; RoHS Compliant: Yes; Min Operating Temperature: -40°C; Case/Package: TSSOP; Max Operating Temperature: 125°C; Pins: 6